# Altium project DP0507-0A0.PrjPcb
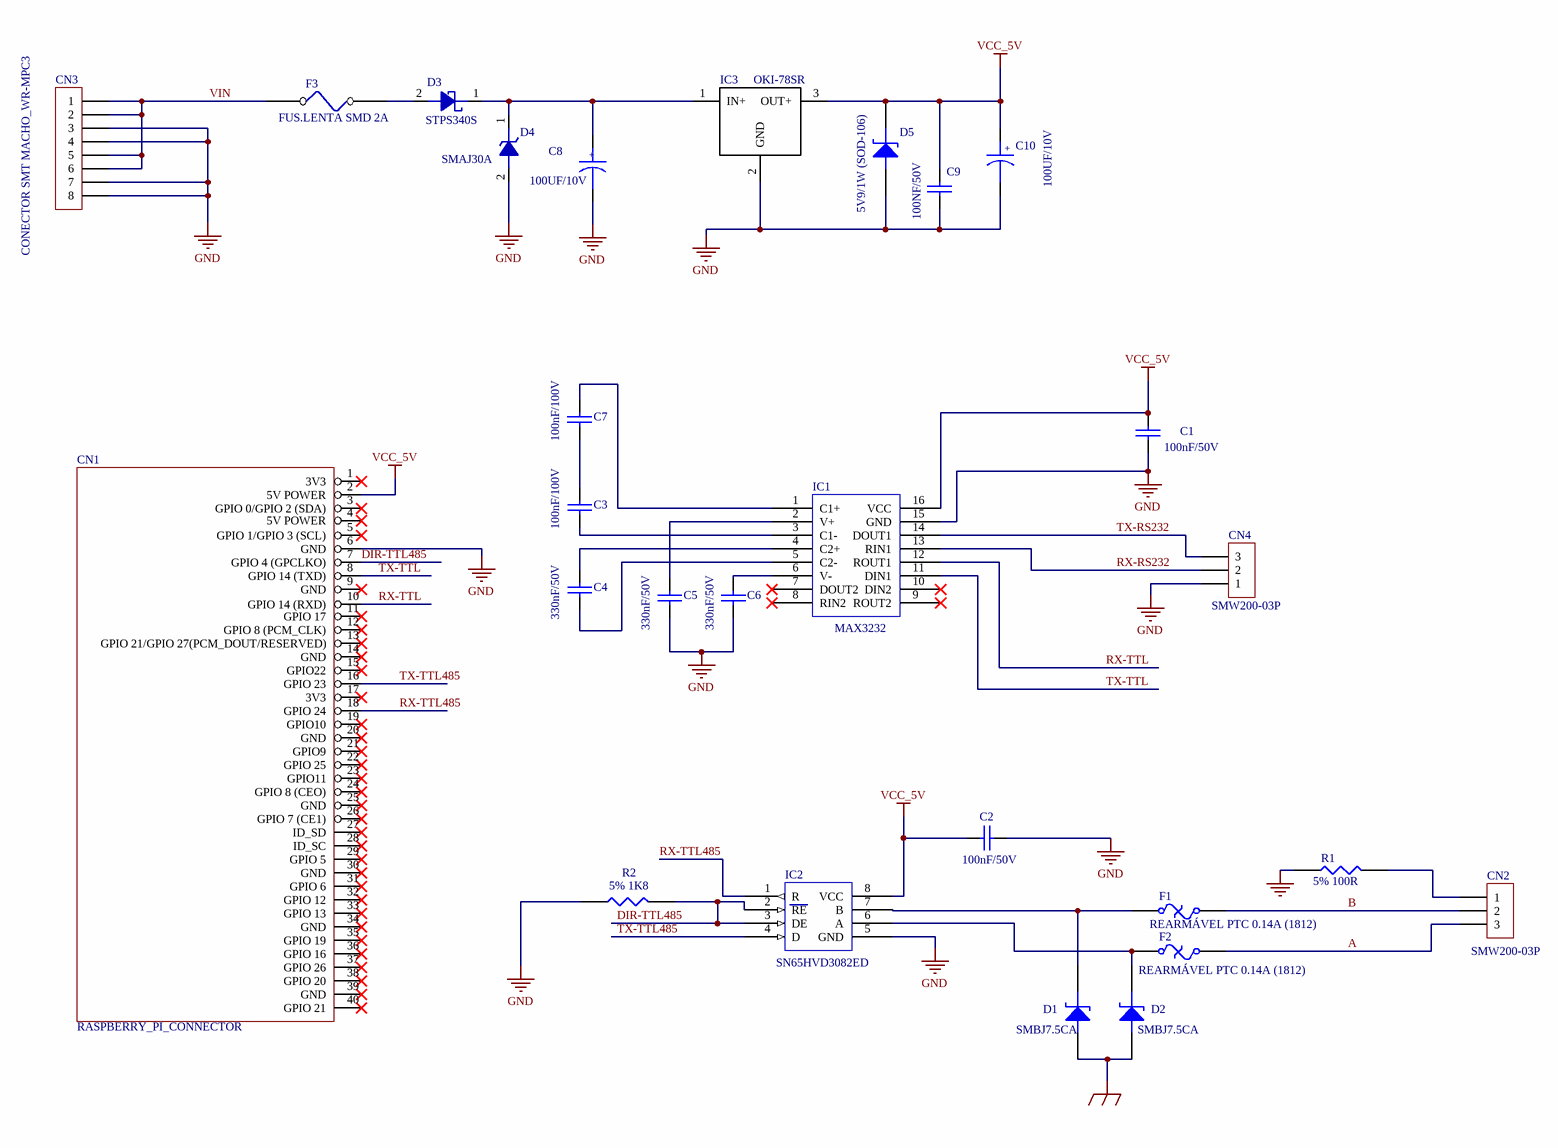
[diagram p0: DP0507-1A0.SchDoc]
1 sheet, 27 parts. Net scope: global (net labels, ports and power ports of the same name join across sheets).
Board files: DP0507-0A0_DWG.PcbDoc, DP0507-0A0.PcbDoc

## Sheet DP0507-1A0.SchDoc: PLACA PIGGYBACK CONSOLA IDL
size A3; ApprovedBy: CALLEBE; CheckedBy: CALLEBE; Author: CALLEBE; DrawnBy: CALLEBE; DocumentNumber: DP0507-1A0; Revision: 0; SheetNumber: 1; SheetTotal: 1

### Parts
C1  B217602  [C0805]  (value not drawn)
C2  B217602  [C0805]  (value not drawn)
C3  VALOR: 100nF/100V  [C0805]  (hidden comment: B217613)
C4  B217631  [C0805]  (value not drawn)
C5  B217631  [C0805]  (value not drawn)
C6  B217631  [C0805]  (value not drawn)
C7  VALOR: 100nF/100V  [C0805]  (hidden comment: B217613)
C8  VALOR: 100UF/10V  [COND ELECT SMD CASE C (TANTALO SMD 100UF/10V)]  (hidden comment: B217600)
C9  VALOR: 100NF/50V  [C0805]  (hidden comment: B217602)
C10  VALOR: 100UF/10V  [COND ELECT SMD CASE C (TANTALO SMD 100UF/10V)]  (hidden comment: B217600)
CN1  E215527  [SMT DUAL SOCKET HEADER BOTTOM (WR-PHD)_2X20PINS]  (value not drawn)
CN2  VALOR: SMW200-03P  [MOLEX-3PINOS-MACHO a 90 graus]  (hidden comment: E215366)
CN3  VALOR: CONECTOR SMT MACHO_WR-MPC3  [CONECTOR SMT MACHO_WR-MPC3_WURTH_8 pinos]  (hidden comment: ---TBD---)
CN4  VALOR: SMW200-03P  [MOLEX-3PINOS-MACHO a 90 graus]  (hidden comment: E215366)
D1  SMBJ7.5CA  [SMB (SMBJ7.5CA)]
D2  SMBJ7.5CA  [SMB (SMBJ7.5CA)]
D3  VALOR: STPS340S  [DO214AB (SMC) - STPS340S]  (hidden comment: A120500)
D4  VALOR: SMAJ30A  [DO214AC (SMA)]  (hidden comment: A102150)
D5  VALOR: 5V9/1W (SOD-106)  [SOD-106]  (hidden comment: A129614)
F1  VALOR: REARMÁVEL PTC 0.14A (1812)  [1812]  (hidden comment: D616404)
F2  VALOR: REARMÁVEL PTC 0.14A (1812)  [1812]  (hidden comment: D616404)
F3  VALOR: FUS.LENTA SMD 2A  [R1206]  (hidden comment: D616400)
IC1  VALOR: MAX3232  [SOIC-16 (MAX3232)]  (hidden comment: MAX3232 (SOIC-16))
IC2  VALOR: SN65HVD3082ED  [PSOP-8]  (hidden comment: SN65HVD3082)
IC3  VALOR: OKI-78SR  [OKI-78SR (TO-220)]  (hidden comment: C110035)
R1  VALOR: 5% 100R  [R0805]  (hidden comment: B306009)
R2  VALOR: 5% 1K8  [R0805]  (hidden comment: B306004)

### Nets
EARTH: D1.2(A) D2.2(A)
GND: C1.2 C2.2 C5.2 C6.2 C8.2 C9.2 C10.2 CN1.6(GND) CN3.3 CN3.4 CN3.7 CN3.8 CN4.1 D4.2(ANODE) D5.2(A) IC1.15(GND) IC2.5(GND) IC3.2(GND) R1.1 R2.1
VCC_5V: C1.1 C2.1 C9.1 C10.1 CN1.2(5V_POWER) D5.1(K) IC1.16(VCC) IC2.8(VCC) IC3.3(OUT+)
A: CN2.3 F2.2
B: CN2.2 F1.2
DIR-TTL485: CN1.7(GPIO_4_(GPCLKO)) IC2.2(RE) IC2.3(DE) R2.2
RX-RS232: CN4.2 IC1.13(RIN1)
RX-TTL: CN1.10(GPIO_14_(RXD)) IC1.12(ROUT1)
RX-TTL485: CN1.18(GPIO_24) IC2.1(R)
TX-RS232: CN4.3 IC1.14(DOUT1)
TX-TTL: CN1.8(GPIO_14_(TXD)) IC1.11(DIN1)
TX-TTL485: CN1.16(GPIO_23) IC2.4(D)
VIN: CN3.1 CN3.2 CN3.5 CN3.6 F3.2
NetC3_1: C3.1 C7.2
NetC3_2: C3.2 IC1.3(C1-)
NetC4_1: C4.1 IC1.4(C2+)
NetC4_2: C4.2 IC1.5(C2-)
NetC5_1: C5.1 IC1.2(V+)
NetC6_1: C6.1 IC1.6(V-)
NetC7_1: C7.1 IC1.1(C1+)
NetC8_1: C8.1 D3.1(CATHODE) D4.1(CATHODE) IC3.1(IN+)
NetCN2_1: CN2.1 R1.2
NetD1_1: D1.1(K) F1.1 IC2.7(B)
NetD2_1: D2.1(K) F2.1 IC2.6(A)
NetD3_2: D3.2(ANODE) F3.1

Not connected (* = marked no-connect by the designer): CN1 1(3V3)* 3(GPIO_0/GPIO_2_(SDA))* 4(5V_POWER)* 5(GPIO_1/GPIO_3_(SCL))* 9(GND)* 11(GPIO_17)* 12(GPIO_8_(PCM_CLK))* 13(GPIO_21/GPIO_27(PCM_DOUT/RESERVED))* 14(GND)* 15(GPIO22)* 17(3V3)* 19(GPIO10)* 20(GND)* 21(GPIO9)* 22(GPIO_25)* 23(GPIO11)* 24(GPIO_8_(CEO))* 25(GND)* 26(GPIO_7_(CE1))* 27(ID_SD)* 28(ID_SC)* 29(GPIO_5)* 30(GND)* 31(GPIO_6)* 32(GPIO_12)* 33(GPIO_13)* 34(GND)* 35(GPIO_19)* 36(GPIO_16)* 37(GPIO_26)* 38(GPIO_20)* 39(GND)* 40(GPIO_21)*; IC1 7(DOUT2)* 8(RIN2)* 9(ROUT2)* 10(DIN2)*

### Notes on the sheet
- File:
- Ref:
- Toler.:
- N/A
- Proj.:
- Drw.:
- Apr.:
- Material:
- Date:
- Scale:
- © Copyright
- A3
- Index:
- (in symbol CAP) 100nF/50V; 330nF/50V
- (in symbol COND. ELECTR. VERT. 220UF/63V) +

### Library data of the parts
C1 C2 = CAP: COND. CERAMICO SMD 10% 100NF (0805) 50V
C3 C7 = CAP: COND. CERAMICO SMD 10% 100NF (0805) 100V
C4-C6 = CAP: COND. CERAMICO SMD 330NF (0805) 50V
C8 C10 = COND. ELECTR. VERT. 220UF/63V: COND. TANTALO SMD 100UF/10V, LOW ESR 10% (2312)
C9 = COND. CERAMICO SMD 10% 100NF (0805) 50V
CN1 = RASPBERRY_PI_CONNECTOR: CONECTOR 2X20 PINOS SMD DP2,54MM; VALOR: RASPBERRY_PI_CONNECTOR
CN2 CN4 = CON3: CONECTOR 3P SMW200-03P (FOR PCB)
CN3 = CON8: CONECTOR SMT MACHO_WR-MPC3_WURTH_8 pinos
D1 D2 = DIODO SMD SMBJ7.5CA: (2): (1); A129603: A129603
D3 = DIODE SCHOTTKY: DIODO SCHOTTKY SMD STPS340S
D4 = DIODE ZENER: DIODO TRANS-ZORB SMAJ30A
D5 = DIODO ZENER 5V6/1W: DIODO ZENER SMD 5V6/1W (SOD-106)
F1 F2 = Fuse Thermal: FUSIVEL FUS.LENTA SMD REARMÁVEL PTC 0.14A (1812)
F3 = FUSIVEL FUS.LENTA SMD 2A
IC1 = MAX3232 (SOIC-16): C.I. SMD MAX3232
IC2 = SN65HVD3082: INTEGRADO 8 PINOS SMD - SN65HVD3082ED
IC3 = OKI-78SR (TO-220): CONVERSOR DC/DC OKI-78SR
R1 = RESISTENCIA SMD: RESISTÊNCIA SMD
R2 = RESISTENCIA SMD 5% 1K8 (0805)